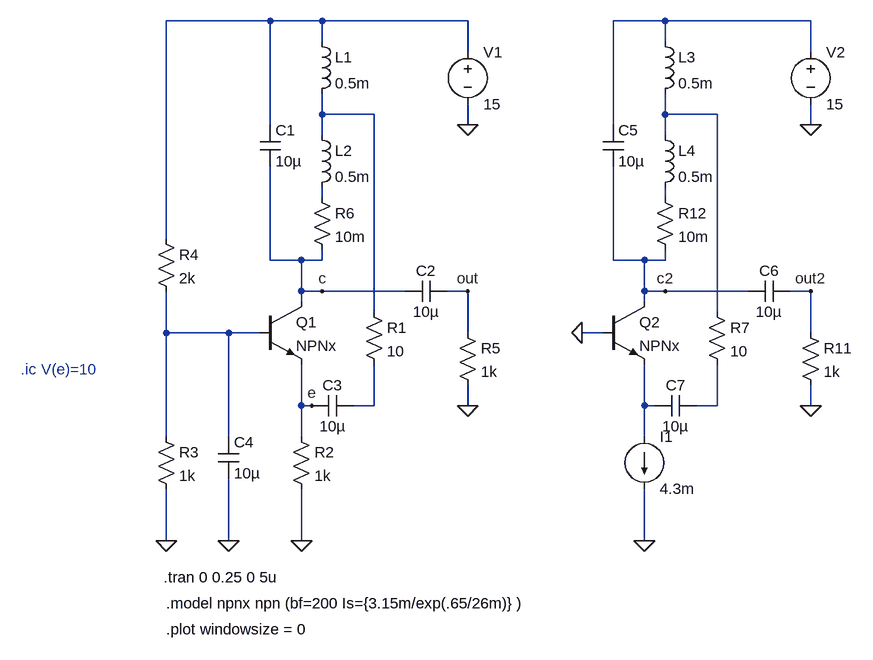
[diagram p0: schematic Hartley_osc.asc]
Hartley_osc.asc, the LTspice schematic file:
Version 4
SHEET 1 920 792
WIRE -256 -192 -416 -192
WIRE -176 -192 -256 -192
WIRE 48 -192 -176 -192
WIRE 352 -192 272 -192
WIRE 576 -192 352 -192
WIRE -176 -160 -176 -192
WIRE 352 -160 352 -192
WIRE 48 -144 48 -192
WIRE 576 -144 576 -192
WIRE -176 -48 -176 -80
WIRE -96 -48 -176 -48
WIRE 352 -48 352 -80
WIRE 432 -48 352 -48
WIRE -256 -32 -256 -192
WIRE 48 -32 48 -64
WIRE 272 -32 272 -192
WIRE 576 -32 576 -64
WIRE -176 -16 -176 -48
WIRE 352 -16 352 -48
WIRE -176 80 -176 64
WIRE 352 80 352 64
WIRE -416 144 -416 -192
WIRE -256 176 -256 32
WIRE -208 176 -256 176
WIRE -176 176 -176 160
WIRE -176 176 -208 176
WIRE 272 176 272 32
WIRE 320 176 272 176
WIRE 352 176 352 160
WIRE 352 176 320 176
WIRE -208 224 -208 176
WIRE -176 224 -208 224
WIRE -48 224 -176 224
WIRE 48 224 16 224
WIRE 320 224 320 176
WIRE 352 224 320 224
WIRE 480 224 352 224
WIRE 576 224 544 224
WIRE -208 240 -208 224
WIRE 320 240 320 224
WIRE -96 256 -96 -48
WIRE 432 256 432 -48
WIRE -416 288 -416 224
WIRE -320 288 -416 288
WIRE -272 288 -320 288
WIRE 48 288 48 224
WIRE 256 288 224 288
WIRE 576 288 576 224
WIRE -208 400 -208 336
WIRE -192 400 -208 400
WIRE -96 400 -96 336
WIRE -96 400 -128 400
WIRE 48 400 48 368
WIRE 320 400 320 336
WIRE 336 400 320 400
WIRE 432 400 432 336
WIRE 432 400 400 400
WIRE 576 400 576 368
WIRE -416 448 -416 288
WIRE -320 448 -320 288
WIRE -208 448 -208 400
WIRE 320 448 320 400
WIRE -416 608 -416 528
WIRE -320 608 -320 512
WIRE -208 608 -208 528
WIRE 320 608 320 528
FLAG -416 608 0
FLAG -320 608 0
FLAG -208 608 0
FLAG 48 400 0
FLAG 48 -32 0
FLAG 48 224 out
FLAG -176 224 c
FLAG -192 400 e
FLAG 320 608 0
FLAG 576 400 0
FLAG 576 -32 0
FLAG 576 224 out2
FLAG 352 224 c2
FLAG 224 288 0
SYMBOL voltage 48 -160 R0
WINDOW 123 0 0 Left 2
WINDOW 39 0 0 Left 2
SYMATTR InstName V1
SYMATTR Value 15
SYMBOL npn -272 240 R0
SYMATTR InstName Q1
SYMATTR Value NPNx
SYMBOL cap -272 -32 R0
SYMATTR InstName C1
SYMATTR Value 10µ
SYMBOL ind -192 -176 R0
SYMATTR InstName L1
SYMATTR Value 0.5m
SYMBOL res -112 240 R0
SYMATTR InstName R1
SYMATTR Value 10
SYMBOL ind -192 -32 R0
SYMATTR InstName L2
SYMATTR Value 0.5m
SYMBOL cap 16 208 R90
WINDOW 0 0 32 VBottom 2
WINDOW 3 32 32 VTop 2
SYMATTR InstName C2
SYMATTR Value 10µ
SYMBOL cap -128 384 R90
WINDOW 0 0 32 VBottom 2
WINDOW 3 32 32 VTop 2
SYMATTR InstName C3
SYMATTR Value 10µ
SYMBOL res -224 432 R0
SYMATTR InstName R2
SYMATTR Value 1k
SYMBOL res -432 432 R0
SYMATTR InstName R3
SYMATTR Value 1k
SYMBOL cap -336 448 R0
SYMATTR InstName C4
SYMATTR Value 10µ
SYMBOL res -432 128 R0
SYMATTR InstName R4
SYMATTR Value 2k
SYMBOL res 32 272 R0
SYMATTR InstName R5
SYMATTR Value 1k
SYMBOL res -192 64 R0
SYMATTR InstName R6
SYMATTR Value 10m
SYMBOL voltage 576 -160 R0
WINDOW 123 0 0 Left 2
WINDOW 39 0 0 Left 2
SYMATTR InstName V2
SYMATTR Value 15
SYMBOL npn 256 240 R0
SYMATTR InstName Q2
SYMATTR Value NPNx
SYMBOL cap 256 -32 R0
SYMATTR InstName C5
SYMATTR Value 10µ
SYMBOL ind 336 -176 R0
SYMATTR InstName L3
SYMATTR Value 0.5m
SYMBOL res 416 240 R0
SYMATTR InstName R7
SYMATTR Value 10
SYMBOL ind 336 -32 R0
SYMATTR InstName L4
SYMATTR Value 0.5m
SYMBOL cap 544 208 R90
WINDOW 0 0 32 VBottom 2
WINDOW 3 32 32 VTop 2
SYMATTR InstName C6
SYMATTR Value 10µ
SYMBOL cap 400 384 R90
WINDOW 0 0 32 VBottom 2
WINDOW 3 32 32 VTop 2
SYMATTR InstName C7
SYMATTR Value 10µ
SYMBOL res 560 272 R0
SYMATTR InstName R11
SYMATTR Value 1k
SYMBOL res 336 64 R0
SYMATTR InstName R12
SYMATTR Value 10m
SYMBOL current 320 448 R0
WINDOW 123 0 0 Left 2
WINDOW 39 0 0 Left 2
SYMATTR InstName I1
SYMATTR Value 4.3m
TEXT -420 664 Left 2 !.tran 0 0.25 0 5u
TEXT -416 704 Left 2 !.model npnx npn (bf=200 Is={3.15m/exp(.65/26m)} )
TEXT -416 744 Left 2 !.plot windowsize = 0
TEXT -640 344 Left 2 ;.ic V(e)=10

The netlist it stands for:
* Hartley_osc.asc
V1 N001 0 15
Q1 c N007 e 0 NPNx
C1 N001 c 10µ
L1 N001 N003 0.5m
R1 N003 N008 10
L2 N003 N005 0.5m
C2 out c 10µ
C3 N008 e 10µ
R2 e 0 1k
R3 N007 0 1k
C4 N007 0 10µ
R4 N001 N007 2k
R5 out 0 1k
R6 N005 c 10m
V2 N002 0 15
Q2 c2 0 N009 0 NPNx
C5 N002 c2 10µ
L3 N002 N004 0.5m
R7 N004 N010 10
L4 N004 N006 0.5m
C6 out2 c2 10µ
C7 N010 N009 10µ
R11 out2 0 1k
R12 N006 c2 10m
I1 N009 0 4.3m
.model NPN NPN
.model PNP PNP
.lib standard.bjt
.tran 0 0.25 0 5u
.model npnx npn (bf=200 Is={3.15m/exp(.65/26m)} )
.plot windowsize = 0
* .ic V(e)=10
.backanno
.end